# EasyEDA schematic SCH_ECE198-12.json
TITLE: Automatic-Garden; REV: 1.2; Date: 2022-10-30; Sheet: 1/1; Drawn By: Damir Gazizullin; Company: University of Waterloo
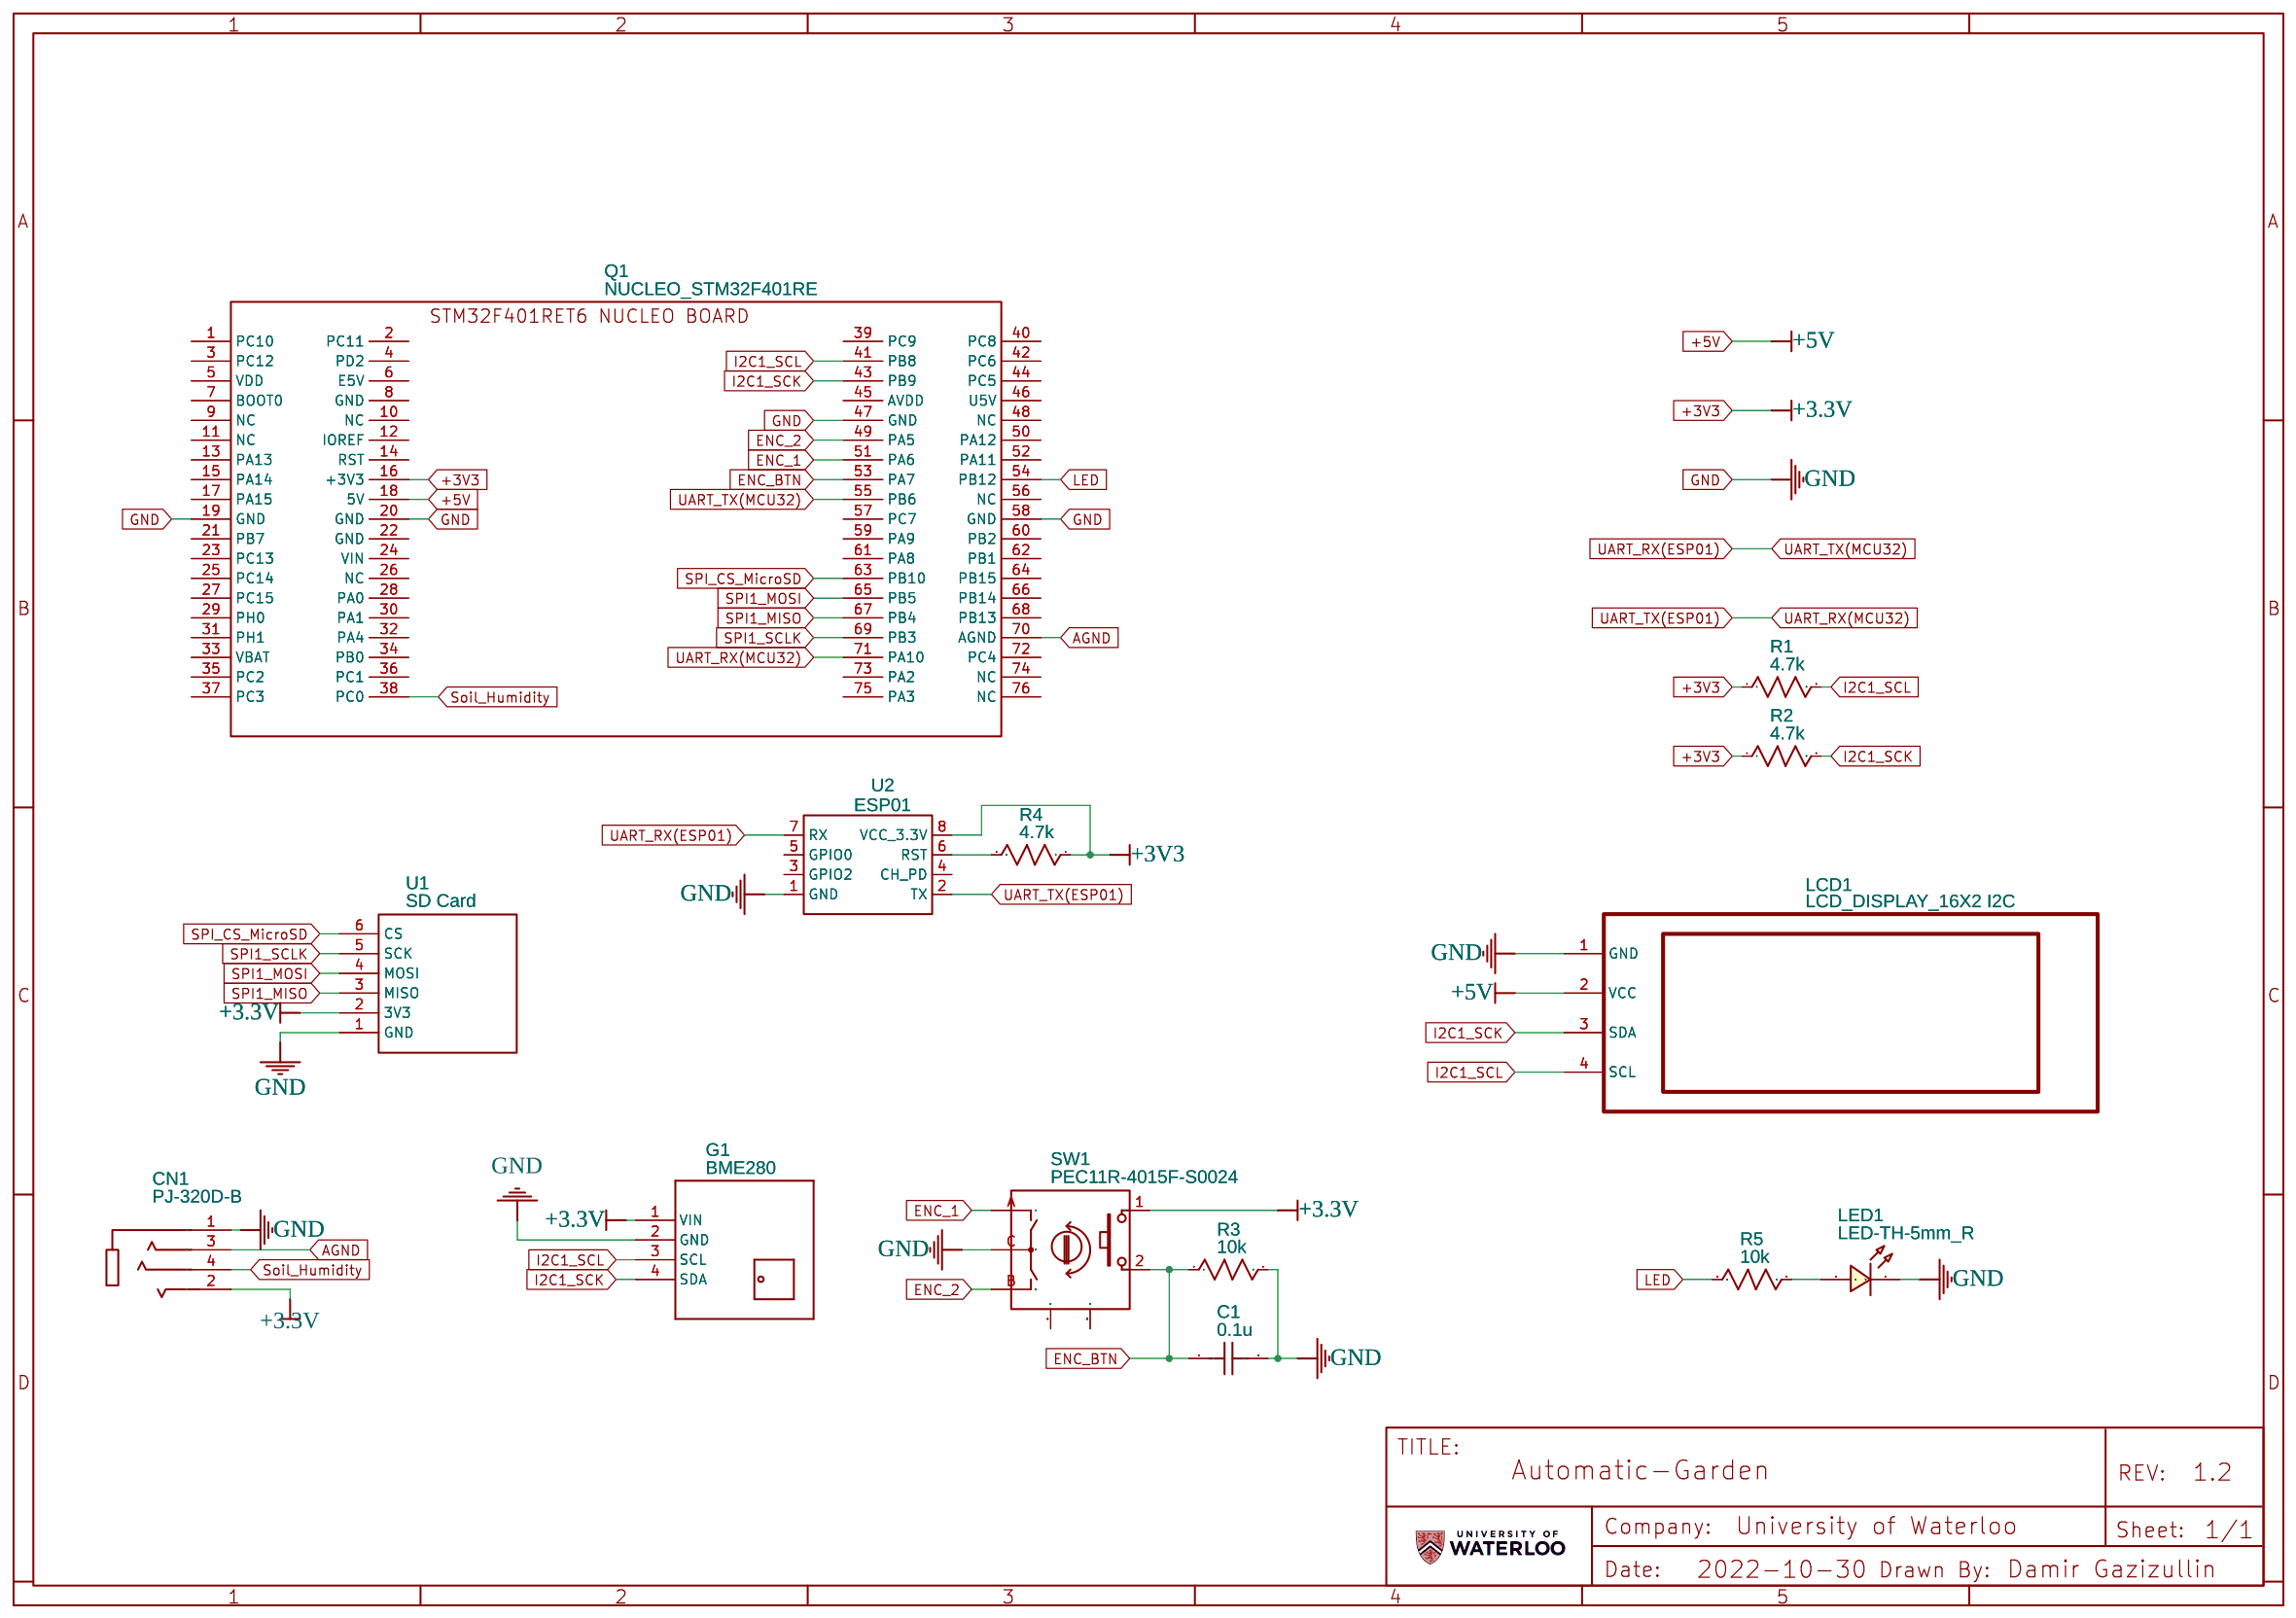
[diagram p0: schematic sheet]

## Parts
C1  0.1u  [RAD-0.3]
CN1  PJ-320D-B  [AUDIO-SMD_XKB_PJ-320D-B]
G1  BME280  [TEMP-HUM-PRES-BME280]
LCD1  LCD_DISPLAY_16X2 I2C  [LCD_2004_4-8BIT_IF LCD_2004_4-8BIT_IF V4 I2C]
LED1  LED-TH-5mm_R  [LED-TH_BD5.0_RED]
Q1  NUCLEO_STM32F401RE  [STM32F401RET6]
R1  4.7k  [R_AXIAL-0.5]
R2  4.7k  [R_AXIAL-0.5]
R3  10k  [R_AXIAL-0.5]
R4  4.7k  [R_AXIAL-0.5]
R5  10k  [R_AXIAL-0.5]
SW1  PEC11R-4015F-S0024  [SW-TH_PEC11R-4XXXF-SXXXX]
U1  SD Card  [SD CARD]
U2  ESP01  [MODUL_ESP01]

## Library data of the parts
C1 = C_0603_US: Contributor: LCEDA_Lib
CN1 = PJ-320D-B: Supplier: LCSC; Supplier Part: C2884940; Manufacturer: XKB Connectivity(中国星坤); Contributor: LCSC; JLCPCB Part Class: Extended Part
G1 = TEMP-HUM-PRES-BME280: Contributor: Azias
LCD1 = LCD_DISPLAY_16X2 I2C: sourceId: yDLFXRL3l; 15: A; Contributor: trailescu andreea
LED1 = LED-TH-5mm_R: Manufacturer: EVERLIGHT(台湾亿光); Manufacturer Part: 333-2SURD/S530-A3; Supplier Part: C87271; Supplier: LCSC; Contributor: LCEDA_Lib
Q1 = NUCLEO_STM32F401RE: Contributor: Дамир Газизуллин; subpart_no: 1; Package Display: No
R1 R2 = R_0603_US: Contributor: LCEDA_Lib
R3-R5 = R_AXIAL-0.5_US: Contributor: LCEDA_Lib
SW1 = PEC11R-4015F-S0024: Supplier: LCSC; Supplier Part: C143789; Manufacturer: BOURNS; Contributor: LCSC; JLCPCB Part Class: Extended Part
U1 = SD Card: Contributor: Дамир Газизуллин
U2 = MODUL_ESP01: Supplier: LCSC; Manufacturer: BOOMELE; Manufacturer Part: Header-Male-2.54_2x3; Supplier Part: C65114

## Nets
+3.3V: CN1.2 G1.1(VIN) Q1.16(+3V3) R1.1 R2.1 R4.1 SW1.1 U1.2(3V3) U2.8(VCC_3.3V)
+5V: LCD1.2(VCC) Q1.18(5V)
AGND: CN1.3 Q1.70(AGND)
GND: C1.2 CN1.1 G1.2(GND) LCD1.1(GND) LED1.2 Q1.19(GND) Q1.20(GND) Q1.47(GND) Q1.58(GND) R3.2 SW1.C U1.1(GND) U2.1(GND)
ENC_1: Q1.51(PA6) SW1.A
ENC_2: Q1.49(PA5) SW1.B
ENC_BTN: C1.1 Q1.53(PA7) R3.1 SW1.2
I2C1_SCK: G1.4(SDA) LCD1.3(SDA) Q1.43(PB9) R2.2
I2C1_SCL: G1.3(SCL) LCD1.4(SCL) Q1.41(PB8) R1.2
LED: Q1.54(PB12) R5.2
Soil_Humidity: CN1.4 Q1.38(PC0)
SPI1_MISO: Q1.67(PB4) U1.3(MISO)
SPI1_MOSI: Q1.65(PB5) U1.4(MOSI)
SPI1_SCLK: Q1.69(PB3) U1.5(SCK)
SPI_CS_MicroSD: Q1.63(PB10) U1.6(CS)
UART_RX(ESP01): Q1.55(PB6) U2.7(RX)
UART_RX(MCU32): Q1.71(PA10) U2.2(TX)
Net-(LED1-1): LED1.1 R5.1
Net-(R4-2): R4.2 U2.6(RST)

Not connected (* = marked no-connect by the designer): Q1 1(PC10) 2(PC11) 3(PC12) 4(PD2) 5(VDD) 6(E5V) 7(BOOT0) 8(GND) 9(NC) 10(NC) 11(NC) 12(IOREF) 13(PA13) 14(RST) 15(PA14) 17(PA15) 21(PB7) 22(GND) 23(PC13) 24(VIN) 25(PC14) 26(NC) 27(PC15) 28(PA0) 29(PH0) 30(PA1) 31(PH1) 32(PA4) 33(VBAT) 34(PB0) 35(PC2) 36(PC1) 37(PC3) 39(PC9) 40(PC8) 42(PC6) 44(PC5) 45(AVDD) 46(U5V) 48(NC) 50(PA12) 52(PA11) 56(NC) 57(PC7) 59(PA9) 60(PB2) 61(PA8) 62(PB1) 64(PB15) 66(PB14) 68(PB13) 72(PC4) 73(PA2) 74(NC) 75(PA3) 76(NC); SW1 MT1 MT2; U2 3(GPIO2) 4(CH_PD) 5(GPIO0)
